# Altium schematic sheet Flow_sensor.SchDoc
size 420 x 297 mm; Address1: Address1; Address2: Address2; Address3: Address3; Address4: Address4; DocumentNumber: *Э3; SheetNumber: 11; SheetTotal: 11; DocumentType: Схема электрическая *
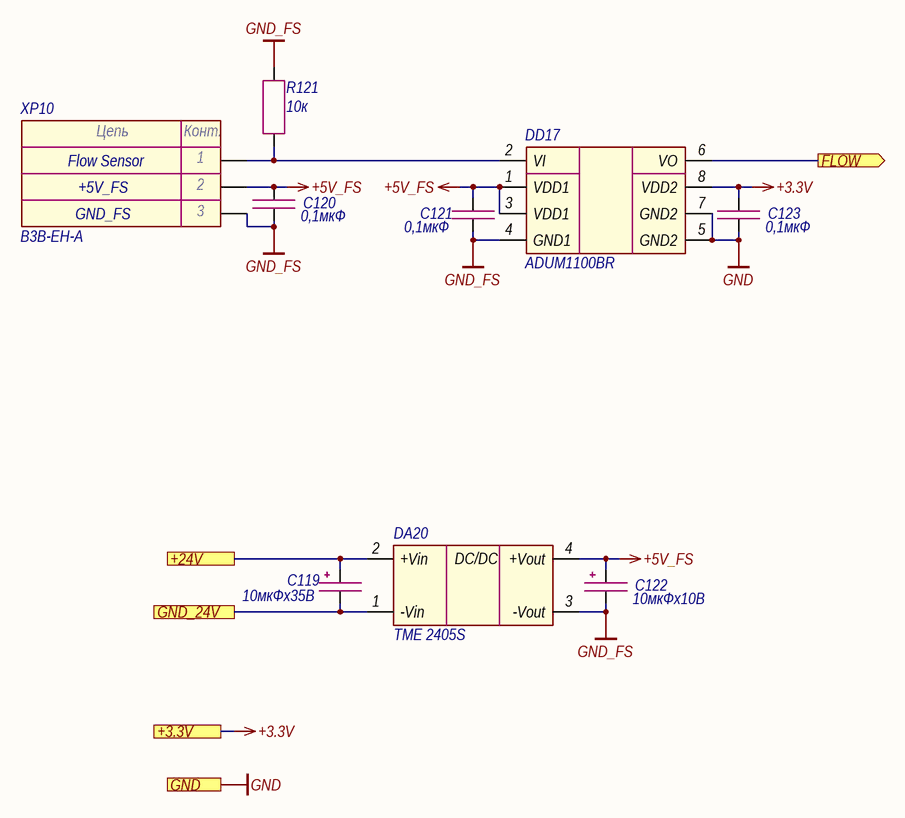
[diagram p0: Flow_sensor.SchDoc]

## Parts
C119  10мкФх35B  [CAP_C]
C120  0,1мкФ  [CAP_0603]
C121  0,1мкФ  [CAP_0603]
C122  10мкФх10B  [CAP_A]
C123  0,1мкФ  [CAP_0603]
DA20  TME 2405S  [TME (SIP-4)]
DD17  ADUM1100BR  [SOIC-8]
R121  10к  [RES_0603]
XP10  B3B-EH-A  [B3B-EH-A]

## Ports
+3.3V (see Main[3C], Ethernet[3D], Fiber_interlock[2C], Hardwiring[3D], LD_driver[1D], Power_supply[1D]), +24V (see Main[2C], Hardwiring[3C], Indication[1C], LD_driver[1D], Power_supply[1D]), FLOW (out, see Main[3C]), GND (see Main[3C], Ethernet[3D], Fiber_interlock[2C], Guide_laser[1C], Hardwiring[3D], Indication[1C], LD_driver[1D], Power_supply[1D]), GND_24V (see Main[2C], Hardwiring[3C], Indication[1C], LD_driver[1D], Power_supply[1D])

## Nets
+3.3V: C123.1 DD17.8(VDD2) ; port +3.3V
+5V_FS: C120.1 C121.1 C122.1 DA20.4(+Vout) DD17.1(VDD1) DD17.3(VDD1) XP10.2
GND: C123.2 DD17.5(GND2) DD17.7(GND2) ; port GND
GND_FS: C120.2 C121.2 C122.2 DA20.3(-Vout) DD17.4(GND1) R121.2 XP10.3
+24V: C119.1 DA20.2(+Vin) ; port +24V
FLOW: DD17.6(VO) ; port FLOW
GND_24V: C119.2 DA20.1(-Vin) ; port GND_24V
NetDD17_2: DD17.2(VI) R121.1 XP10.1

## Notes on the sheet
- +5V_FS
- Flow Sensor
- GND_FS
- Подп. и дата
- Инв. № дубл.
- Взам. инв. №
- Инв. № подл.
- Изм.
- Лист
- № докум.
- Подп.
- Дата
- Копировал
- Формат А3
- (in symbol Connector-3) Цепь; Конт.
- (in symbol TME) DC/DC

## Library data of the parts
C119 = Capacitor_Polar: Model: TECAP, 10 мкФ, 35 В, тип C, 10%; Value: 10мкФх35B; Document: *; Manufacturer: *
C120 C121 C123 = Capacitor: Manufacturer: Murata; Model: GRM188R71H104KA93D; Value: 0,1мкФ; Document: *
C122 = Capacitor_Polar: Model: TECAP, 10 мкФ, 10 В, тип A, 10%; Value: 10мкФх10B; Document: *; Manufacturer: *
DA20 = TME: Manufacturer: Traco Power; Model: TME 2405S; Document: *
DD17 = ADUM1100: Manufacturer: Analog Devices; Model: ADUM1100BR; Document: *
R121 = Resistor: Manufacturer: Yageo; Model: RC0603FR-0710KL; Value: 10к; Document: *
XP10 = Connector-3: Manufacturer: JST; Model: B3B-EH-A; Document: *